# EAGLE design 16197^2 (EAGLE 7.6.0)
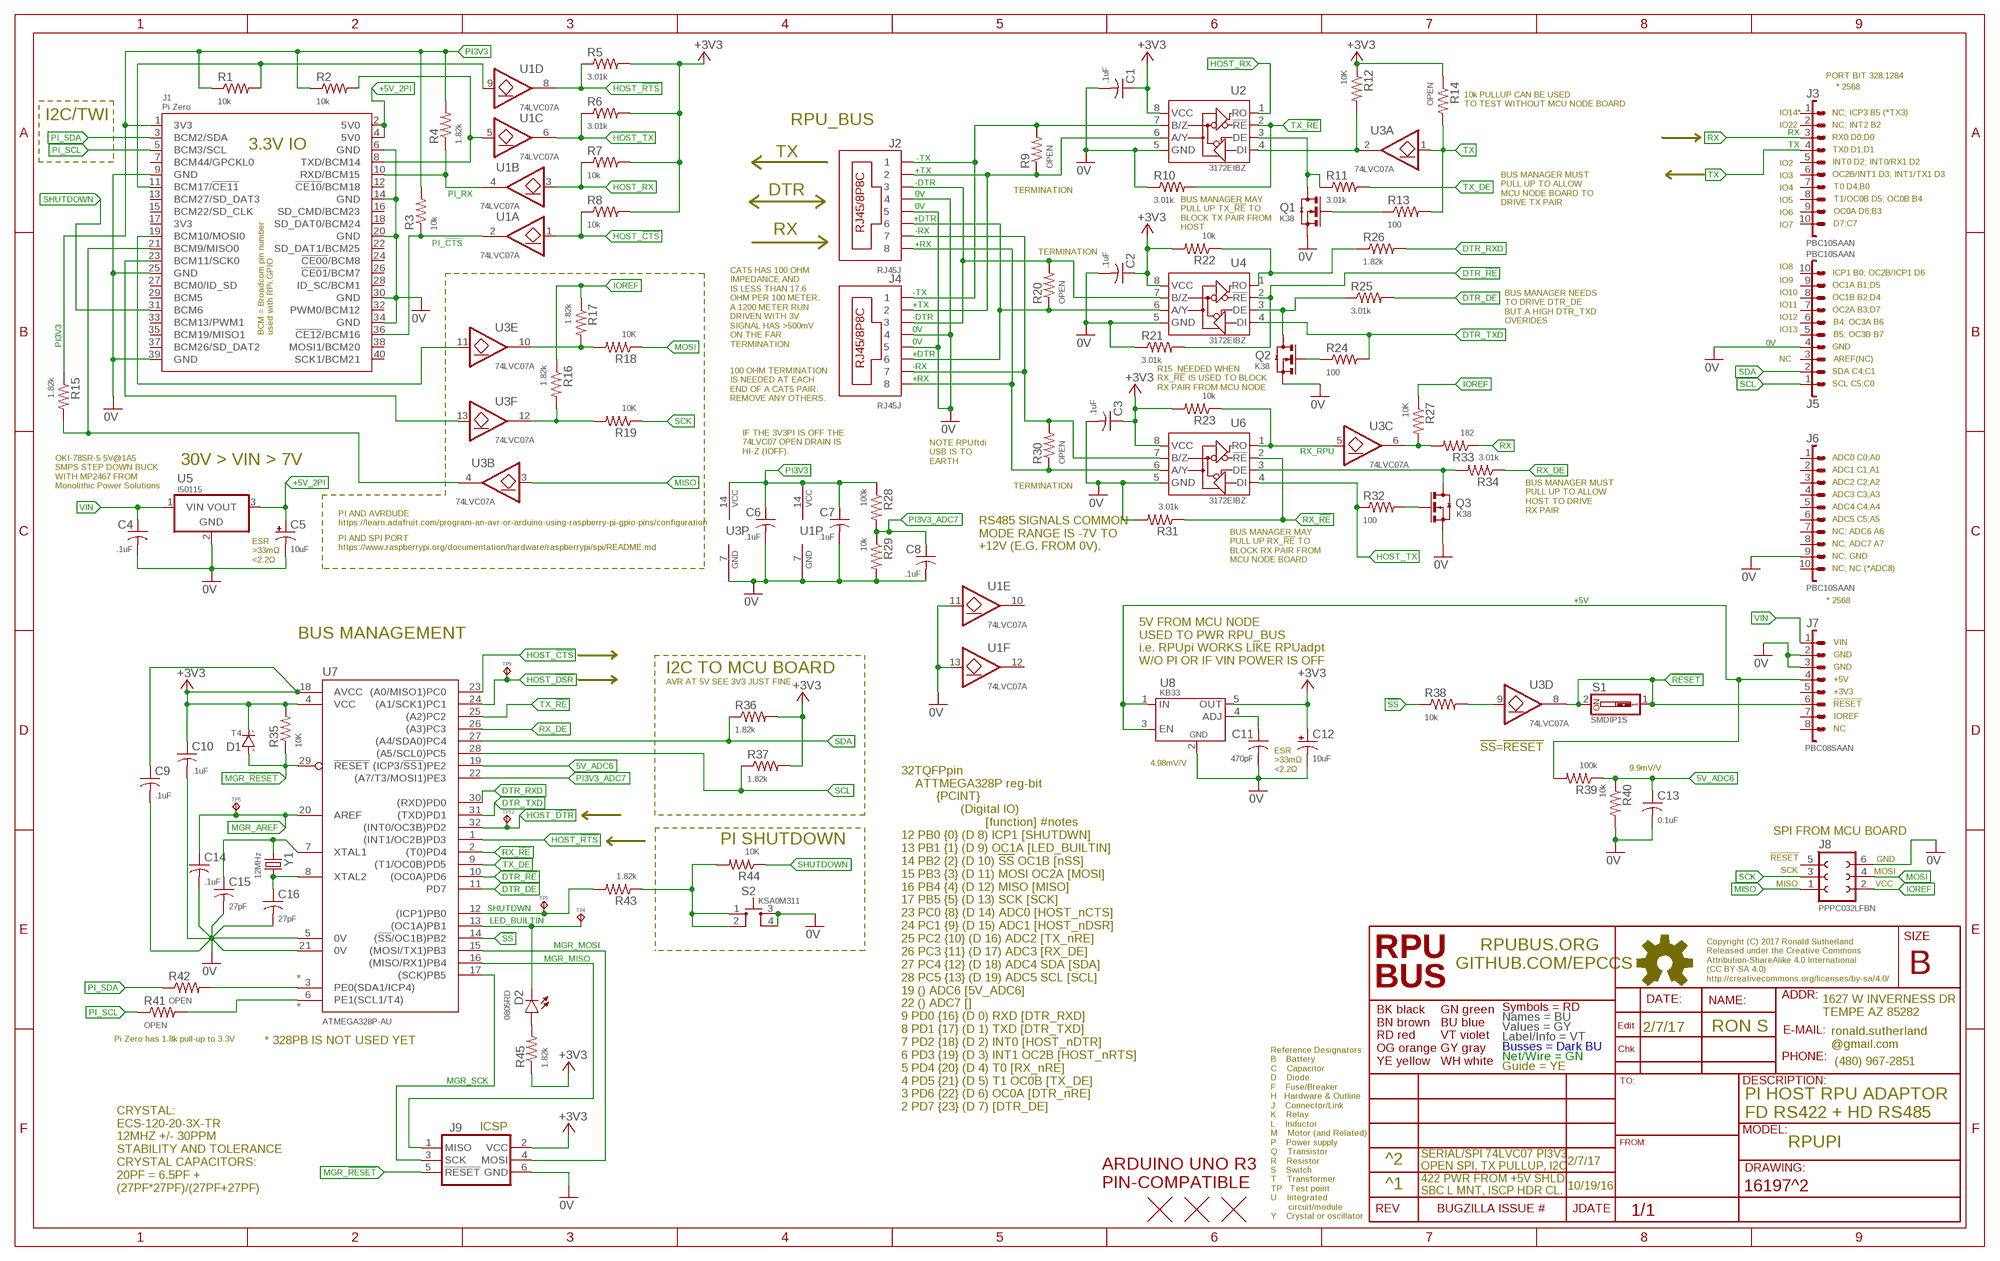
[diagram p0: schematic, sheet 1]

## Parts
C1  .1uF  CC0603A  [C0603(1608)]
C2  .1uF  CC0603A  [C0603(1608)]
C3  .1uF  CC0603A  [C0603(1608)]
C4  .1uF  CC0603A  [C0603(1608)]
C5  10uF  CT1206  [3216]
C6  .1uF  CC0603A  [C0603(1608)]
C7  .1uF  CC0603A  [C0603(1608)]
C8  .1uF  CC0603A  [C0603(1608)]
C9  .1uF  CC0603A  [C0603(1608)]
C10  .1uF  CC0603A  [C0603(1608)]
C11  470pF  CC0603A  [C0603(1608)]
C12  10uF  CT1206  [3216]
C13  0.1uF  CC0603A  [C0603(1608)]
C14  .1uF  CC0603A  [C0603(1608)]
C15  27pF  CC0603A  [C0603(1608)]
C16  27pF  CC0603A  [C0603(1608)]
D1  T4  DSOD123  [SOD123]
D2  0805RD  LEDC0805(2012)  [C0805(2012)]
J1  Pi Zero  RPI-ZERO90  [RASPI_ZERO_V40PIN]
J2  RJ45J  RJ45-8HZT  [RJ45-8HZT]
J3  PBC10SAAN  1X10"  [1X10]
J4  RJ45J  RJ45-8HZT  [RJ45-8HZT]
J5  PBC10SAAN  1X10"  [1X10]
J6  PBC10SAAN  1X10"  [1X10]
J7  PBC08SAAN  1X8"  [1X8]
J8  PPPC032LFBN  F2X3  [F2X3]
J9  ISP-SPIPTH  [ISP]
Q1  K38  N-CHSOT23  [SOT23]
Q2  K38  N-CHSOT23  [SOT23]
Q3  K38  N-CHSOT23  [SOT23]
R1  10k  R0805  [C0805(2012)]
R2  10k  R0805  [C0805(2012)]
R3  10k  R0805  [C0805(2012)]
R4  1.82k  R0805  [C0805(2012)]
R5  3.01k  R0805  [C0805(2012)]
R6  3.01k  R0805  [C0805(2012)]
R7  10k  R0805  [C0805(2012)]
R8  10k  R0805  [C0805(2012)]
R9  OPEN  R0805  [C0805(2012)]
R10  3.01k  R0805  [C0805(2012)]
R11  3.01k  R0805  [C0805(2012)]
R12  10K  R0805  [C0805(2012)]
R13  100  R0805  [C0805(2012)]
R14  OPEN  R0805  [C0805(2012)]
R15  1.82k  R0805  [C0805(2012)]
R16  1.82k  R0805  [C0805(2012)]
R17  1.82k  R0805  [C0805(2012)]
R18  10K  R0805  [C0805(2012)]
R19  10K  R0805  [C0805(2012)]
R20  OPEN  R0805  [C0805(2012)]
R21  3.01k  R0805  [C0805(2012)]
R22  10k  R0805  [C0805(2012)]
R23  10k  R0805  [C0805(2012)]
R24  100  R0805  [C0805(2012)]
R25  3.01k  R0805  [C0805(2012)]
R26  1.82k  R0805  [C0805(2012)]
R27  10K  R0805  [C0805(2012)]
R28  100k  R0805  [C0805(2012)]
R29  10k  R0805  [C0805(2012)]
R30  OPEN  R0805  [C0805(2012)]
R31  3.01k  R0805  [C0805(2012)]
R32  100  R0805  [C0805(2012)]
R33  182  R0805  [C0805(2012)]
R34  3.01k  R0805  [C0805(2012)]
R35  10K  R0805  [C0805(2012)]
R36  1.82k  R0805  [C0805(2012)]
R37  1.82k  R0805  [C0805(2012)]
R38  10k  R0805  [C0805(2012)]
R39  100k  R0805  [C0805(2012)]
R40  10k  R0805  [C0805(2012)]
R41  OPEN  R0805  [C0805(2012)]
R42  OPEN  R0805  [C0805(2012)]
R43  1.82k  R0805  [C0805(2012)]
R44  10K  R0805  [C0805(2012)]
R45  1.82k  R0805  [C0805(2012)]
S1  SMDIP1S  SW_DIP-1SMD  [SMD-DIPSWITCH-1]
S2  KSA0M311  [0M311]
TP1  TPPAD1-08  [P1-08]
TP4  TPPAD1-08  [P1-08]
TP5  TPPAD1-08  [P1-08]
TP9  TPPAD1-08  [P1-08]
TP12  TPPAD1-08  [P1-08]
U1  74LVC07A  7407D  [14SOIC]
U2  3172EIBZ  ISL3172EIBZ  [SOIC8]
U3  74LVC07A  7407D  [14SOIC]
U4  3172EIBZ  ISL3172EIBZ  [SOIC8]
U5  I50115  OKI-78SR-H  [OKI-78SR-H]
U6  3172EIBZ  ISL3172EIBZ  [SOIC8]
U7  ATMEGA328P-AU  ATMEGA328PB-AU  [TQFP32-08]
U8  KB33  MIC5205  [SOT23-5,SOT25]
U$1  ARDUINO-UNO  [ARDUINO_UNO]
U$2  FIDUCIAL1.27  [FIDUCIAL-1.27]
U$3  FIDUCIAL1.27  [FIDUCIAL-1.27]
U$4  FIDUCIAL1.27  [FIDUCIAL-1.27]
Y1  12MHz  CSM-3X  [CSM-3X]

## Nets
0V: C1.2 C2.2 C3.2 C4.2 C5.- C6.2 C7.2 C8.2 C9.2 C10.2 C11.2 C12.- C13.2 C14.2 C15.2 C16.2 J1.6(GND) J1.9(GND) J1.14(GND) J1.20(GND) J1.25(GND) J1.30(GND) J1.34(GND) J1.39(GND) J2.4 J2.5 J4.4 J4.5 J5.4 J6.9 J7.2 J7.3 J8.6 J9.6(GND) Q1.2(S)(S) Q2.2(S)(S) Q3.2(S)(S) R10.1 R21.1 R29.2 R31.2 R40.2 S2.3 S2.4 U1.7(P:GND) U1.11(E:I) U1.13(F:I) U2.5(GND) U3.7(P:GND) U4.5(GND) U5.2(GND) U6.5(GND) U7.5(0V) U7.21(0V) U8.2(GND)
5V_ADC6: C13.1 R39.1 R40.1 U7.19((ICP3/!SS1!)PE2)
!RESET: J7.6 S1.1 S1.2 U3.8(D:O)
!SS!: R38.1 U7.14((!SS!/OC1B)PB2)
+3V3: C1.1 C2.1 C3.1 C9.1 C10.1 C12.+ D1.C(K) J9.2(VCC) R5.2 R6.2 R7.2 R8.2 R12.1 R14.1 R22.2 R23.2 R35.2 R36.2 R37.2 R45.1 U2.8(VCC) U4.8(VCC) U6.8(VCC) U7.4(VCC) U7.18(AVCC) U8.5(OUT)
+5V: J7.4 R39.2 U8.1(IN) U8.3(EN)
+5V_2PI: C5.+ J1.2(5V0) J1.4(5V0) U5.3(VOUT)
+DTR: J2.6 J4.6 R20.1 U4.6(A/Y)
+RX: J2.8 J4.8 R30.1 U6.6(A/Y)
+TX: J2.2 J4.2 R9.1 U2.6(A/Y)
-DTR: J2.3 J4.3 R20.2 U4.7(B/Z)
-RX: J2.7 J4.7 R30.2 U6.7(B/Z)
-TX: J2.1 J4.1 R9.2 U2.7(B/Z)
DTR_!RE: R21.2 U4.2(!RE) U7.10((OC0A)PD6)
DTR_DE: R25.2 U7.11(PD7)
DTR_RXD: R26.2 U7.30((RXD)PD0)
DTR_TXD: R24.2 U4.4(DI) U7.31((TXD)PD1)
HOST_!CTS: R8.1 U1.1(A:I) U7.23((A0/MISO1)PC0)
HOST_!DSR: TP9.TP U7.24((A1/SCK1)PC1)
HOST_!DTR: TP12.TP U7.32((INT0/OC3B)PD2)
HOST_!RTS: R5.1 U1.8(D:O) U7.1((INT1/OC2B)PD3)
HOST_MISO: J1.21(BCM9/MISO0) R15.2 U3.4(B:O)
HOST_MOSI: J1.19(BCM10/MOSI0) U3.11(E:I)
HOST_RX: R7.1 U1.3(B:I) U2.1(RO)
HOST_SCK: J1.23(BCM11/SCK0) U3.13(F:I)
HOST_TX: R6.1 R32.1 U1.6(C:O) U6.4(DI)
IOREF: J8.2 R16.1 R17.1 R27.1
LED_BUILTIN: D2.K TP4.TP U7.13((OC1A)PB1)
MGR_!RESET: D1.A J9.5(!RESET) R35.1 U7.29(!RESET)
MGR_AREF: C14.1 TP5.TP U7.20(AREF)
MGR_MISO: J9.1(MISO) U7.16((MISO/RX1)PB4)
MGR_MOSI: J9.4(MOSI) U7.15((MOSI/TX1)PB3)
MGR_SCK: J9.3(SCK) U7.17((SCK)PB5)
MISO: J8.1 U3.3(B:I)
MOSI: J8.4 R18.1
N$1: J1.8(TXD/BCM14) R2.2 U1.5(C:I)
N$2: R38.2 U3.9(D:I)
N$4: J1.11(BCM17/!CE11!) R1.2 U1.9(D:I)
N$5: R16.2 R19.2 U3.12(F:O)
N$6: R17.2 R18.2 U3.10(E:O)
N$7: R43.1 R44.2 S2.1 S2.2
N$10: R27.2 R33.2 U3.6(C:O)
N$11: Q3.3(D)(D) R34.2 U6.3(DE)
N$15: Q1.1(G)(G) R13.1
N$18: Q1.3(D)(D) R11.1 U2.3(DE)
N$19: R22.1 R26.1 U4.1(RO)
N$20: Q2.3(D)(D) R25.1 U4.3(DE)
N$22: Q2.1(G)(G) R24.1
N$24: C11.1 U8.4(ADJ)
N$25: Q3.1(G)(G) R32.2
N$29: D2.A R45.2
PI3V3: C6.1 C7.1 J1.1(3V3) R1.1 R2.1 R3.2 R4.2 R15.1 R28.1 U1.14(P:VCC) U3.14(P:VCC)
PI3V3_ADC7: C8.1 R28.2 R29.1 U7.22((A7/T3/MOSI1)PE3)
PI_!CTS: J1.36(!CE12!/BCM16) R3.1 U1.2(A:O)
PI_RX: J1.10(RXD/BCM15) R4.1 U1.4(B:O)
PI_SCL: J1.5(BCM3/SCL) R41.1
PI_SDA: J1.3(BCM2/SDA) R42.1
RX: J3.3 R33.1
RX_!RE: R31.1 U6.2(!RE) U7.2((T0)PD4)
RX_DE: R34.1 U7.26((A3)PC3)
RX_RPU: R23.1 U3.5(C:I) U6.1(RO)
SCK: J8.3 R19.1
SCL: J5.1 R37.1 U7.28((A5/SCL0)PC5)
SCL1: R41.2 U7.6(PE1(SCL1/T4))
SDA: J5.2 R36.1 U7.27((A4/SDA0)PC4)
SDA1: R42.2 U7.3(PE0(SDA1/ICP4))
SHUTDOWN: J1.31(BCM6) R44.1
SHUTDWN: R43.2 TP1.TP U7.12((ICP1)PB0)
TX: J3.4 R13.2 R14.2 U3.1(A:I)
TX_!RE: R10.2 U2.2(!RE) U7.25((A2)PC2)
TX_DE: R11.2 U7.9((T1/OC0B)PD5)
TX_RPU: R12.2 U2.4(DI) U3.2(A:O)
VIN: C4.1 J7.1 U5.1(VIN)
XTAL1: C15.1 U7.7(XTAL1) Y1.1
XTAL2: C16.1 U7.8(XTAL2) Y1.2
Unconnected: J1.7(BCM44/GPCKL0) J1.12(!CE10!/BCM18) J1.13(BCM27/SD_DAT3) J1.15(BCM22/SD_CLK) J1.16(SD_CMD/BCM23) J1.17(3V3) J1.18(SD_DAT0/BCM24) J1.22(SD_DAT1/BCM25) J1.24(!CE00!/BCM8) J1.26(!CE01!/BCM7) J1.27(BCM0/ID_SD) J1.28(ID_SC/BCM1) J1.29(BCM5) J1.32(PWM0/BCM12) J1.33(BCM13/PWM1) J1.35(BCM19/MISO1) J1.37(BCM26/SD_DAT2) J1.38(MOSI1/BCM20) J1.40(SCK1/BCM21) J3.1 J3.2 J3.5 J3.6 J3.7 J3.8 J3.9 J3.10 J5.3 J5.5 J5.6 J5.7 J5.8 J5.9 J5.10 J6.1 J6.2 J6.3 J6.4 J6.5 J6.6 J6.7 J6.8 J6.10 J7.5 J7.7 J7.8 J8.5 U1.10(E:O) U1.12(F:O)

## Notes on the sheet
- PORT BIT 328;1284
- * 2568
- 10k PULLUP CAN BE USED 
  TO TEST WITHOUT MCU NODE BOARD
- IO14* | NC; ICP3 B5 (*TX3)
- I2C/TWI
- RPU_BUS | IO22 | NC; INT2 B2
- RX0 D0;D0
- TX0 D1;D1
- TX
- IO2 | INT0 D2; INT0/RX1 D2
- IO3 | OC2B/INT1 D3; INT1/TX1 D3
- IO4 | T0 D4;B0
- DTR | TERMINATION
- IO5 | T1/OC0B D5; OC0B B4
- BUS MANAGER MUST
  PULL UP TO ALLOW 
  MCU NODE BOARD TO 
  DRIVE TX PAIR
- IO6 | OC0A D6;B3
- IO7 | D7;C7
- BUS MANAGER MAY
  PULL UP TX_!RE! TO 
  BLOCK TX PAIR FROM 
  HOST
- RX
- TERMINATION
- IO8
- ICP1 B0; OC2B/ICP1 D6
- IO9
- OC1A B1;D5
- IO10
- OC1B B2;D4
- IO11
- OC2A B3;D7
- IO12
- BUS MANAGER NEEDS
  TO DRIVE DTR_DE
  BUT A HIGH DTR_TXD
  OVERIDES
- B4; OC3A B6
- IO13
- B5; OC3B B7
- CAT5 HAS 100 OHM 
  IMPEDANCE AND 
  IS LESS THAN 17.6 
  OHM PER 100 METER. 
  A 1200 METER RUN
  DRIVEN WITH 3V 
  SIGNAL HAS >500mV
  ON THE FAR
  TERMINATION
- GND
- NC | AREF(NC)
- SDA C4;C1
- SCL C5;C0
- R15  NEEDED WHEN 
  RX_!RE! IS USED TO BLOCK 
  RX PAIR FROM MCU NODE
- 100 OHM TERMINATION
  IS NEEDED AT EACH
  END OF A CAT5 PAIR.
  REMOVE ANY OTHERS.
- IF THE 3V3PI IS OFF THE
  74LVC07 OPEN DRAIN IS
  HI-Z (IOFF).
- ADC0 C0;A0
- NOTE RPUftdi 
  USB IS TO 
  EARTH
- 30V > VIN > 7V
- ADC1 C1;A1
- ADC2 C2;A2
- OKI-78SR-5 5V@1A5
  SMPS STEP DOWN BUCK
  WITH MP2467 FROM 
  Monolithic Power Solutions
- TERMINATION
- ADC3 C3;A3
- ADC4 C4;A4
- BUS MANAGER MUST
  PULL UP TO ALLOW 
  HOST TO DRIVE
  RX PAIR
- ADC5 C5;A5
- PI AND AVRDUDE
  https://learn.adafruit.com/program-an-avr-or-arduino-using-raspberry-pi-gpio-pins/configuration
- NC; ADC6 A6
- NC; ADC7 A7
- PI AND SPI PORT
  https://www.raspberrypi.org/documentation/hardware/raspberrypi/spi/README.md
- RS485 SIGNALS COMMON 
  MODE RANGE IS -7V TO 
  +12V (E.G. FROM 0V).
- NC; GND
- ESR
  >33mΩ
  <2.2Ω
- BUS MANAGER MAY
  PULL UP RX_!RE! TO 
  BLOCK RX PAIR FROM
  MCU NODE BOARD
- NC; NC (*ADC8)
- * 2568
- BUS MANAGEMENT
- VIN
- GND
- 5V FROM MCU NODE
  USED TO PWR RPU_BUS
  i.e. RPUpi WORKS LIKE RPUadpt
  W/O PI OR IF VIN POWER IS OFF
- GND
- I2C TO MCU BOARD
- AVR AT 5V SEE 3V3 JUST FINE. | +5V
- +3V3
- !RESET
- IOREF
- NC
- !SS!=!RESET!
- 4.98mV/V
- 9.9mV/V
- ESR
  >33mΩ
  <2.2Ω
- SPI FROM MCU BOARD
- PI SHUTDOWN
- !RESET
- GND
- SCK
- MOSI
- MISO
- VCC
- *
- *
- 2/7/17 | RON S
- Pi Zero has 1.8k pull-up to 3.3V
- * 328PB IS NOT USED YET
- 32TQFPpin
      ATTMEGA328P reg-bit
            {PCINT}
                   (Digital IO)
                          [function] #notes
  12 PB0 {0} (D 8) ICP1 [SHUTDWN]
  13 PB1 {1} (D 9) OC1A [LED_BUILTIN]
  14 PB2 {2} (D 10) !SS! OC1B [nSS]
  15 PB3 {3} (D 11) MOSI OC2A [MOSI]
  16 PB4 {4} (D 12) MISO [MISO]
  17 PB5 {5} (D 13) SCK [SCK]
  23 PC0 {8} (D 14) ADC0 [HOST_nCTS]
  24 PC1 {9} (D 15) ADC1 [HOST_nDSR]
  25 PC2 {10} (D 16) ADC2 [TX_nRE]
  26 PC3 {11} (D 17) ADC3 [RX_DE]
  27 PC4 {12} (D 18) ADC4 SDA [SDA]
  28 PC5 {13} (D 19) ADC5 SCL [SCL]
  19 () ADC6 [5V_ADC6]
  22 () ADC7 []
  9 PD0 {16} (D 0) RXD [DTR_RXD]
  8 PD1 {17} (D 1) TXD [DTR_TXD]
  7 PD2 {18} (D 2) INT0 [HOST_nDTR]
  6 PD3 {19} (D 3) INT1 OC2B [HOST_nRTS]
  5 PD4 {20} (D 4) T0 [RX_nRE]
  4 PD5 {21} (D 5) T1 OC0B [TX_DE]
  3 PD6 {22} (D 6) OC0A [DTR_nRE]
  2 PD7 {23} (D 7) [DTR_DE]
- PI HOST RPU ADAPTOR 
  FD RS422 + HD RS485
- ICSP
- RPUPI
- ^2 | 2/7/17
- SERIAL/SPI 74LVC07 PI3V3
  OPEN SPI, TX PULLUP, I2C
- ^1 | 10/19/16
- CRYSTAL:
  ECS-120-20-3X-TR
  12MHZ +/- 30PPM
  STABILITY AND TOLERANCE
  CRYSTAL CAPACITORS:
  20PF = 6.5PF +
  (27PF*27PF)/(27PF+27PF)
- 422 PWR FROM +5V SHLD,
  SBC L MNT, ISCP HDR CL.

## Library data of the parts
C1-C4 C6-C11 C13-C16 = C-C:C: CAPACITOR Symbol
C5 C12 = C-T:CT: Tantalum Electrolytic Capacitor
D1 = D-GP:D: DIODE
D2 = D-LED:LED: LED 120120WH [CREE,XHGAWT-00-0000-00000HXE1] LED WHITE 6500K 150LUM-W120120
J1 = U-Pi:RPI-ZERO: Raspberry Pi Zero https://pinout.xyz/ NOTE: WiFi is needed see https://www.kickstarter.com/projects/1991736672/iot-hat-for-raspberry-pi-a-must-have-for-pi-zero
J2 J4 = J-RJ45:RJ45-8: RJ45 Jack RJ45J [ASSMANN,A-2014-2-4-R] JACK MODULAR VERT PCB 8P8C UNSHIELD Horz version form sparkfun sku PRT-00643, and breakout board sku is BOB-00716.
J3 J5 J6 = J-HDR2.54mm:1X10: 10 POS HEADER PBC10S [SULLINS,PBC10SAAN]HEADER MALE BRKWAY 10POS .1IN AA
J7 = J-HDR2.54mm:1X8: 8 POS HEADER PBC08SAAN [SULLINS,PBC08SAAN]HEADER MALE BRKWAY 8POS .1IN AA
J8 = J-HDR2.54mm:F2X3: FEMALE HEADER 2X3POS
J9 = U-AVR:ISP-SPI: AVR ISP thru SPI In-System Programming uses the target Atmel AVR’s internal SPI (Serial Peripheral Interface) to download code into the flash and EEPROM memories. It is not a debugging interface. When designing an application PCB which includes an AVR with the SPI interface, this pinout should be used. Sparkfun SKU: BOB-08508
Q1-Q3 = Q-NCH:N-CH?*: ENHANCEMENT MODE MOSFET SOT23 is BSS138 pinout
R1-R45 = R-C:R: Resiistor American-style symbol
S1 = S-Toggle:SW_DIP-1
S2 = S-Tactile:KSA: KSA0M311 [C&K,KSA0M311LFT] SWITCH TACTILE SEALED SPST-NO 50MA 32V
TP1 TP4 TP5 TP9 TP12 = J-TP:TP: Test pad
U1 U3 = U-7400:74*07: HEX BUFFER, OPEN DRAIN/COLLECTOR 74LVC07A [DIODES,74LVC07AS14-13] LOGIC BUFFER OPEN DRAIN 14SOIC
U2 U4 U6 = U-Transceiver:ISL3172E: TRANSCEIVER RS485 3.3V HALFDPLX
U5 = P-DCDC:OKI-78SR: OKI-78SR OKI-78SR-5/1.5-W36H-C 5V@1.5A Horizontal Mount OKI-78SR-5/1.5-W36-C 5V@1.5A Vert Mount OKI-78SR-3.3/1.5-W36H-C 3.3V@1.5A Horizontal Mount OKI-78SR-3.3/1.5-W36-C 3.3V@1.5A Vert Mount Murata Power Solutions 7 to 36 VDC input range need to verify pinout
U7 = U-AVR:ATMEGA328PB-AU: ATmega328PB 4 Kbytes FLASH 128 bytes SRAM 256 bytes EEPROM 2 UART, 2 I2C, 2 SPI 8-channel 10 bit ADC
U8 = P-DCDC:MIC5205: KB33 [MICREL,MIC5205-3.3YM5] REG ULDO 3V3 150MA SOT23-5
U$1 = J-BoardHDR:ARDUINO-UNO: Board Outline with holes and silk note the board dim layer is not defined
U$2-U$4 = H-Fiducial:FIDUCIAL: Fiducial Alignment Points Various fiducial points for machine vision alignment.
Y1 = Y-XTL:CSM: 16MHZ20 [ECS,ECS-160-20-3X-TR] CRYSTAL 16MHZ 20PF 30PPM CSM-3X

## Net classes
0 default: width 0.254 mm, drill 0.33 mm

## Board
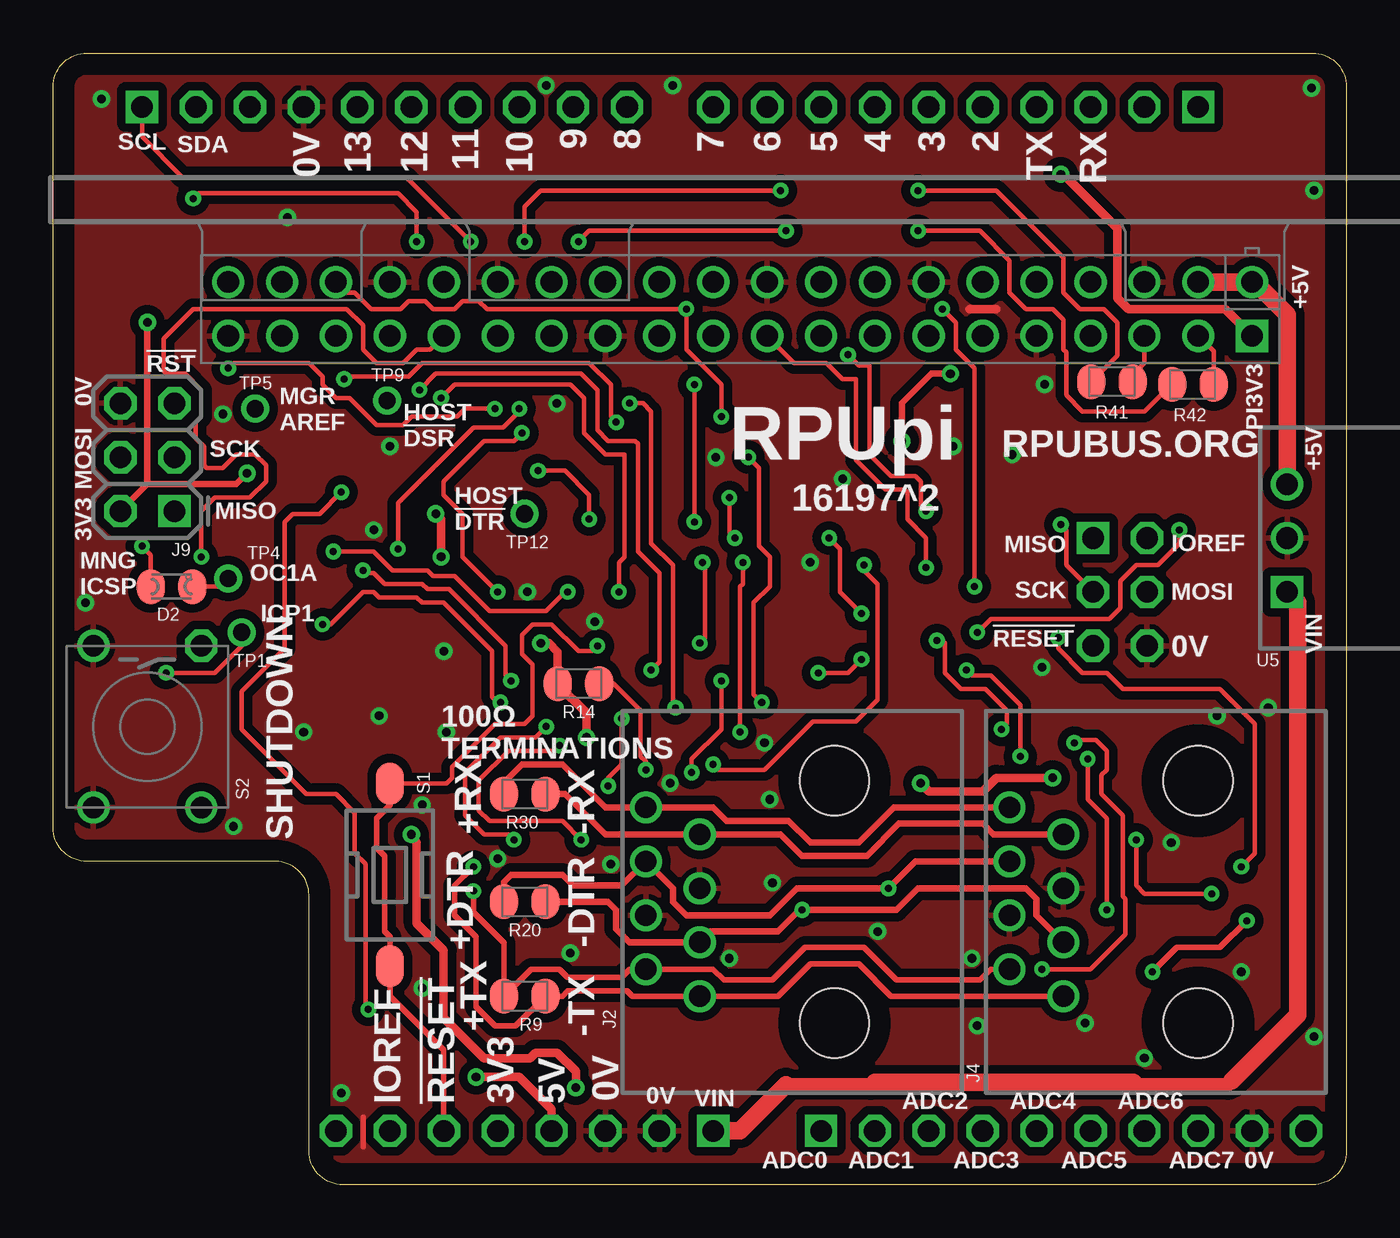
[diagram p1: board, top side]
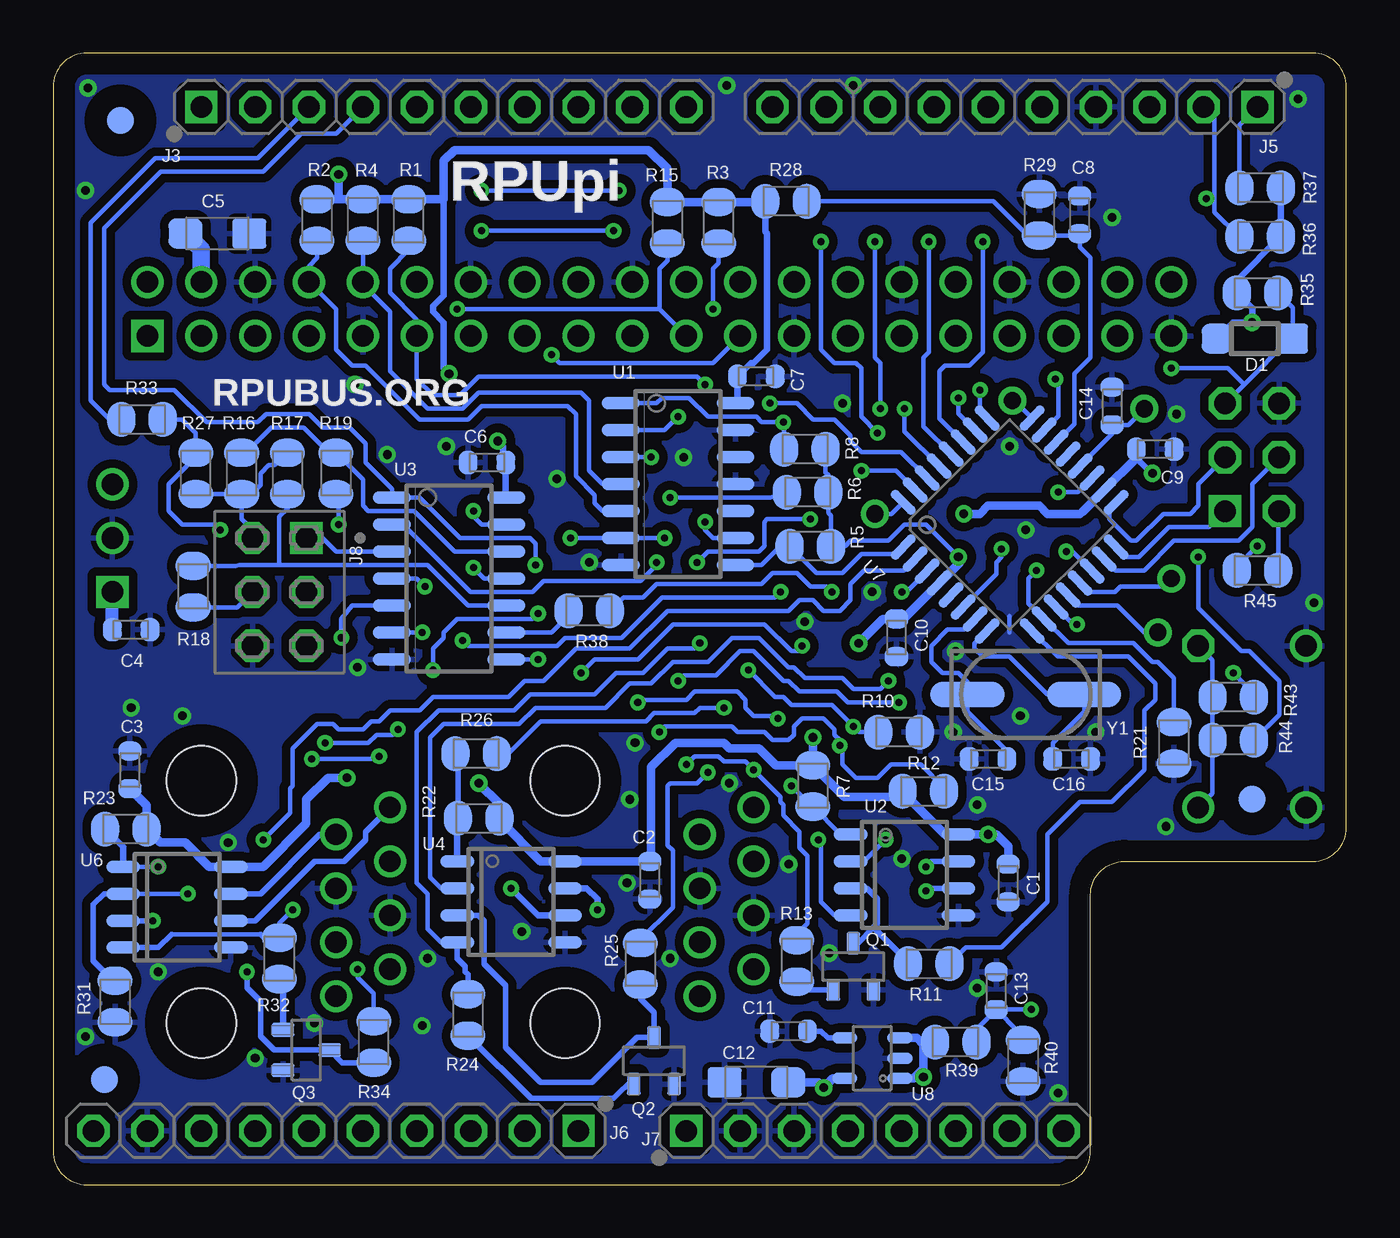
[diagram p2: board, bottom side, seen from below]

Size 60.96 x 53.34 mm. Coordinates in mm from the lower left corner, seen from the top.
Outline: 60.96,51.75 60.96,1.59 arc-90 59.37,0 13.65,0 arc-90 12.06,1.59 12.06,13.65 arc90 10.48,15.24 1.59,15.24 arc-90 0,16.83 0,51.75 arc-90 1.59,53.34 59.37,53.34 arc-90 60.96,51.75
Copper layers (1*16): Top 0.034290625mm / dielectric 60mil / Bottom 0.034290625mm
Design rules "default *": minimum track width 10mil, minimum drill 13mil, track to track 8mil, track to pad 8mil, pad to pad 8mil, via to via 8mil, smd to smd 8mil, copper to edge 40mil, drill to drill 12mil, minimum pad ring 10mil, minimum via ring 8mil, stop-mask expansion 4mil, vias tented up to drill 17mil, thermal gap 10mil

### Footprints (pad centres in the part's own frame; a part is rotated, then mirrored left to right if it is on the bottom)
C0603(1608) = smd 0.898 x 1.1: 1 -0.889,0; 2 0.889,0
3216 = smd 1.6 x 1.4: + -1.5,0; - 1.5,0
SOD123 = smd 1.4 x 1.4: A 1.8,0; C -1.8,0
C0805(2012) = smd 1.321 x 1.651: A 0.977,0; K -0.977,0
RASPI_ZERO_V40PIN = drill 1.016 square: 1 0,2.54 | drill 1.016: 2 0,0; 3 2.54,2.54; 4 2.54,0; 5 5.08,2.54; 6 5.08,0; 7 7.62,2.54; 8 7.62,0; 9 10.16,2.54; 10 10.16,0; 11 12.7,2.54; 12 12.7,0; 13 15.24,2.54; 14 15.24,0; 15 17.78,2.54; 16 17.78,0; 17 20.32,2.54; 18 20.32,0; 19 22.86,2.54; 20 22.86,0; 21 25.4,2.54; 22 25.4,0; 23 27.94,2.54; 24 27.94,0; 25 30.48,2.54; 26 30.48,0; 27 33.02,2.54; 28 33.02,0; 29 35.56,2.54; 30 35.56,0; 31 38.1,2.54; 32 38.1,0; 33 40.64,2.54; 34 40.64,0; 35 43.18,2.54; 36 43.18,0; 37 45.72,2.54; 38 45.72,0; 39 48.26,2.54; 40 48.26,0
RJ45-8HZT = drill 1: 1 -4.445,6.35; 2 -3.175,8.89; 3 -1.905,6.35; 4 -0.635,8.89; 5 0.635,6.35; 6 1.905,8.89; 7 3.175,6.35; 8 4.445,8.89 | hole 3.264: -5.715,0; 5.715,0
1X10 = drill 1.016 square: 1 0,0 | drill 1.016 octagon: 2 2.54,0; 3 5.08,0; 4 7.62,0; 5 10.16,0; 6 12.7,0; 7 15.24,0; 8 17.78,0; 9 20.32,0; 10 22.86,0
1X8 = drill 1.016 square: 1 0,0 | drill 1.016 octagon: 2 2.54,0; 3 5.08,0; 4 7.62,0; 5 10.16,0; 6 12.7,0; 7 15.24,0; 8 17.78,0
F2X3 = drill 1.016 square: 1 0,0 | drill 1.016 octagon: 2 0,-2.54; 3 2.54,0; 4 2.54,-2.54; 5 5.08,0; 6 5.08,-2.54
ISP = drill 1.016 square: 1 0,0 | drill 1.016 octagon: 2 0,2.54; 3 2.54,0; 4 2.54,2.54; 5 5.08,0; 6 5.08,2.54
SOT23 = smd 0.65 x 1.06: 1(G) -0.95,-1.1; 2(S) 0.95,-1.1; 3(D) 0,1.1
C0805(2012)' = smd 1.321 x 1.651: 1 -0.977,0; 2 0.977,0
SMD-DIPSWITCH-1 = smd 1.3 x 2: 1 0,-4.3; 2 0,4.3
0M311 = drill 1.016 octagon: 1 -3.81,2.54 | drill 1.016: 2 3.81,2.54; 3 -3.81,-2.54; 4 3.81,-2.54
P1-08 = drill 0.813: TP 0,0
14SOIC = smd 0.6 x 1.8: 1 -3.81,-2.7; 2 -2.54,-2.7; 3 -1.27,-2.7; 4 0,-2.7; 5 1.27,-2.7; 6 2.54,-2.7; 7 3.81,-2.7; 8 3.81,2.7; 9 2.54,2.7; 10 1.27,2.7; 11 0,2.7; 12 -1.27,2.7; 13 -2.54,2.7; 14 -3.81,2.7
SOIC8 = smd 0.6 x 1.6: 1 -1.905,-2.54; 2 -0.635,-2.54; 3 0.635,-2.54; 4 1.905,-2.54; 5 1.905,2.54; 6 0.635,2.54; 7 -0.635,2.54; 8 -1.905,2.54
OKI-78SR-H = drill 1.016 square: 1 0,0 | drill 1.016: 2 -2.54,0; 3 -5.08,0
TQFP32-08 = smd 1.5 x 0.45: 1 -4.293,2.8; 2 -4.293,2; 3 -4.293,1.2; 4 -4.293,0.4; 5 -4.293,-0.4; 6 -4.293,-1.2; 7 -4.293,-2; 8 -4.293,-2.8; 17 4.293,-2.8; 18 4.293,-2; 19 4.293,-1.2; 20 4.293,-0.4; 21 4.293,0.4; 22 4.293,1.2; 23 4.293,2; 24 4.293,2.8 | smd 0.45 x 1.5: 9 -2.8,-4.293; 10 -2,-4.293; 11 -1.2,-4.293; 12 -0.4,-4.293; 13 0.4,-4.293; 14 1.2,-4.293; 15 2,-4.293; 16 2.8,-4.293; 25 2.8,4.293; 26 2,4.293; 27 1.2,4.293; 28 0.4,4.293; 29 -0.4,4.293; 30 -1.2,4.293; 31 -2,4.293; 32 -2.8,4.293
SOT23-5,SOT25 = smd 0.55 x 1.2: 1 -0.95,-1.3; 2 0,-1.3; 3 0.95,-1.3; 4 0.95,1.3; 5 -0.95,1.3
FIDUCIAL-1.27 = smd 1.27 x 1.27: 1 0,0
CSM-3X = smd 3.5 x 1.2: 1 -2.75,0; 2 2.75,0

### Placement (x,y rotation side)
C1  15.94,14.22 270 bottom
C2  32.83,14.35 270 bottom
C3  57.34,19.56 90 bottom
C4  57.28,26.16 0 bottom
C5  53.21,44.83 0 bottom
C6  40.51,34.04 180 bottom
C7  27.81,38.1 0 bottom
C8  12.57,45.72 90 bottom
C9  9.02,34.67 0 bottom
C10  21.21,25.78 270 bottom
C11  26.29,7.24 180 bottom
C12  27.81,4.83 180 bottom
C13  16.51,9.14 90 bottom
C14  11.05,36.7 90 bottom
C15  16.89,20.07 180 bottom
C16  12.95,20.07 0 bottom
D1  4.32,39.88 0 bottom
D2  5.59,28.19 180 top
J1  56.52,42.55 180 top
J2  36.83,13.34 90 top
J3  53.98,50.8 0 bottom
J4  53.98,13.34 90 top
J5  4.19,50.8 180 bottom
J6  36.2,2.54 180 bottom
J7  31.12,2.54 0 bottom
J8  49.02,30.48 270 bottom
J9  5.71,31.75 90 top
Q1  23.24,10.29 0 bottom
Q2  32.64,5.84 0 bottom
Q3  49.02,6.35 270 bottom
R1  10k  [C0805(2012)']  44.2,45.47 270 bottom
R2  10k  [C0805(2012)']  48.51,45.47 270 bottom
R3  10k  [C0805(2012)']  29.59,45.34 90 bottom
R4  1.82k  [C0805(2012)']  46.35,45.47 90 bottom
R5  3.01k  [C0805(2012)']  25.27,30.1 0 bottom
R6  3.01k  [C0805(2012)']  25.4,32.64 0 bottom
R7  10k  [C0805(2012)']  25.15,18.8 90 bottom
R8  10k  [C0805(2012)']  25.53,34.67 0 bottom
R9  OPEN  [C0805(2012)']  22.23,8.89 0 top
R10  3.01k  [C0805(2012)']  21.08,21.34 180 bottom
R11  3.01k  [C0805(2012)']  19.69,10.41 0 bottom
R12  10K  [C0805(2012)']  19.94,18.54 0 bottom
R13  100  [C0805(2012)']  25.91,10.54 90 bottom
R14  OPEN  [C0805(2012)']  24.77,23.62 0 top
R15  1.82k  [C0805(2012)']  32,45.34 270 bottom
R16  1.82k  [C0805(2012)']  52.07,33.53 90 bottom
R17  1.82k  [C0805(2012)']  49.91,33.53 270 bottom
R18  10K  [C0805(2012)']  54.36,28.19 90 bottom
R19  10K  [C0805(2012)']  47.62,33.53 90 bottom
R20  OPEN  [C0805(2012)']  22.23,13.34 0 top
R21  3.01k  [C0805(2012)']  8.13,20.83 90 bottom
R22  10k  [C0805(2012)']  40.89,17.27 0 bottom
R23  10k  [C0805(2012)']  57.53,16.76 0 bottom
R24  100  [C0805(2012)']  41.4,8 90 bottom
R25  3.01k  [C0805(2012)']  33.27,10.41 90 bottom
R26  1.82k  [C0805(2012)']  41.02,20.32 0 bottom
R27  10K  [C0805(2012)']  54.23,33.53 90 bottom
R28  100k  [C0805(2012)']  26.42,46.35 0 bottom
R29  10k  [C0805(2012)']  14.48,45.72 90 bottom
R30  OPEN  [C0805(2012)']  22.23,18.41 0 top
R31  3.01k  [C0805(2012)']  58.04,8.64 270 bottom
R32  100  [C0805(2012)']  50.29,10.67 270 bottom
R33  182  [C0805(2012)']  56.77,36.07 0 bottom
R34  3.01k  [C0805(2012)']  45.85,6.73 270 bottom
R35  10K  [C0805(2012)']  4.19,42.04 180 bottom
R36  1.82k  [C0805(2012)']  4.06,44.7 0 bottom
R37  1.82k  [C0805(2012)']  4.06,46.99 0 bottom
R38  10k  [C0805(2012)']  35.69,27.05 180 bottom
R39  100k  [C0805(2012)']  18.42,6.73 180 bottom
R40  10k  [C0805(2012)']  15.24,5.84 270 bottom
R41  OPEN  [C0805(2012)']  49.91,37.85 180 top
R42  OPEN  [C0805(2012)']  53.72,37.72 180 top
R43  1.82k  [C0805(2012)']  5.33,22.99 0 bottom
R44  10K  [C0805(2012)']  5.33,20.95 180 bottom
R45  1.82k  [C0805(2012)']  4.19,28.96 180 bottom
S1  15.88,14.61 0 top
S2  4.45,21.59 270 top
TP1  8.89,26.04 0 top
TP4  8.26,28.57 0 top
TP5  9.53,36.58 0 top
TP9  15.75,36.96 0 top
TP12  22.23,31.62 0 top
U1  31.5,33.02 270 bottom
U2  20.83,14.61 270 bottom
U3  42.29,28.57 270 bottom
U4  39.37,13.34 270 bottom
U5  58.17,27.94 270 top
U6  55.12,13.08 270 bottom
U7  15.88,31.11 45 bottom
U8  22.35,5.97 90 bottom
U$1  -14.61,0 0 top  (outside the outline)
U$2  57.78,50.16 0 bottom
U$3  4.45,18.16 0 bottom
U$4  58.55,4.95 0 bottom
Y1  15.11,23.11 0 bottom

### Tracks (layer width: path | path; a pad name or v marks a point on that pad's centre or on a via)
0V  (via drill 0.41)
  Top 0.254: 14.61,1.78 14.61,3.17
  Top 0.406: 43.18,41.27 44.45,41.27
  Bottom 0.203: 15.88,26.04 15.88,26.8
  other vias: 2.29,51.18 23.24,51.82 29.21,51.82 59.31,51.69 56.01,10.03 54.86,22.1 42.42,34.8 48.64,7.62 38.86,11.94 1.52,27.43 8.51,16.89 52.7,16.13 59.44,46.86 13.59,4.32 33.91,14.22 24.38,10.92 43.31,10.67 35.69,29.34 33.53,20.83 45.21,34.42 31.24,34.29 33.78,18.16 29.08,18.92 26.29,15.11 43.56,7.49 57.28,22.48 59.44,6.99 51.43,5.97 15.37,22.1 18.42,25.15 20.96,15.37 17.4,9.27 17.4,17.91 15.11,30.86 15.88,34.8 8,36.32 11.05,45.59 46.74,37.72 37.21,33.27 46.61,24.38 31.88,10.67 18.54,21.34 11.81,21.34 25.53,26.54 22.35,27.94 23.75,36.83
  pour Top (isolate 0.406): 11.43,0 11.43,14.61 0,14.61 0,53.34 60.96,53.34 60.96,0
  pour Bottom (isolate 0.406): 0,53.34 60.96,53.34 60.96,0 11.43,0 11.43,14.61 0,14.61
5V_ADC6  (via drill 0.33)
  Top 0.203: v14.86,8.26 14.73,8.38 14.73,15.11 14.22,15.62 14.22,17.53 13.33,18.41 11.94,18.41 8.89,21.46 8.89,23.24 10.92,25.27 10.92,31.24 11.3,31.62 12.57,31.62 v13.59,32.64
  Bottom 0.203: R39.1 17.44,7.33 C13.1 | R40.1 15.49,7.24 C13.1 | C13.1 v14.86,8.26 | v13.59,32.64 12.65,32.64 U7.19
!RESET  (via drill 0.33)
  Top 0.203: v38.1,24.77 37.46,24.13 v36.07,24.13 | S1.2 15.89,18.92 18.54,18.92 18.8,19.18 18.8,19.68 20.83,21.72 22.23,21.72 22.61,22.1 22.61,24.51 22.1,25.02 22.1,25.91 22.61,26.42 23.5,26.42 24.77,25.15 25.4,25.15 v25.65,25.4
  Top 0.254: J7.6 18.42,6.35 15.88,8.89 S1.1 15.88,11.68 15.62,11.94 15.62,15.49 15.24,15.88 15.24,17.27 15.88,17.91 S1.2
  Bottom 0.203: U3.8 v38.1,24.77 | v36.07,24.13 35.43,24.77 33.4,24.77 31.75,26.42 27.43,26.42 26.16,25.15 25.78,25.15 v25.65,25.4
!SS!  (via drill 0.33)
  Top 0.203: v24.26,27.94 24.13,27.94 23.24,27.05 20.57,27.05 18.92,28.7 17.91,28.7 17.65,28.96 16,28.96 15.11,29.84 v13.21,29.84
  Bottom 0.203: R38.1 34.07,27.69 33.15,27.69 32.51,28.32 27.56,28.32 27.05,28.83 25.91,28.83 25.27,28.19 24.51,28.19 v24.26,27.94 | v13.21,29.84 12.91,29.84 U7.14
+3V3  (via drill 0.41)
  Top 0.305: v9.14,33.53 8.64,33.02 4.45,33.02 | 4.45,33.02 J9.2 | v4.45,40.64 4.45,33.02
  Top 0.406: v25.15,21.08 25.15,22.23 23.79,23.58 R14.1 23.79,25.11 23.37,25.53 v22.99,25.53 | v24.64,4.57 24.64,5.33 23.75,6.22 22.73,6.22 22.48,5.97 20.32,5.97 18.42,7.87 18.42,11.05 17.15,12.32 17.15,16.13 v16.89,16.51 | v40.89,18.92 41.27,18.54 43.81,18.54 44.45,19.18 v47.12,19.18 | v18.29,29.59 18.29,31.37 v18.03,31.62
  Bottom 0.203: R45.1 3.21,31.71 J9.2 | v18.29,29.59 19.81,31.11 20.83,31.11 21.59,30.35 23.37,30.35 23.62,30.1 R5.2 24.3,31.54 24.42,31.66 R6.2 24.42,33.44 24.55,33.57 R8.2 | R12.1 20.92,18.33 20.96,18.29
  Bottom 0.305: R22.2 39.92,17.18 | 9.91,34.26 9.18,33.53 v9.14,33.53 | R37.2 R36.2 5.17,42.62 R35.2 4.45,41.31 v4.45,40.64 5.36,40.64 D1.C
  Bottom 0.406: 39.92,17.18 37.97,15.24 U4.8 C2.1 32.77,15.3 32.77,19.68 31.62,20.83 29.34,20.83 29.08,20.57 27.69,20.57 26.89,19.77 R7.2 | U8.5 24.19,5.02 v24.64,4.57 24.89,4.83 C12.+ | C1.1 15.94,15.94 16.51,16.51 v16.89,16.51 U2.8 18.92,16.51 20.7,18.29 20.96,18.29 23.66,18.29 R7.2 | R22.2 39.92,17.95 v40.89,18.92 | v47.12,19.18 48.01,19.18 49.02,18.16 49.02,17.02 51.05,14.99 U6.8 53.59,14.99 54.74,16.13 55.92,16.13 R23.2 56.55,17.88 C3.1 57.53,18.67 | v25.15,21.08 R7.2 | v22.99,25.53 21.84,26.67 C10.1 20.89,26.67 U7.4 18.22,29.34 v18.29,29.59 | v18.03,31.62 17.27,31.62 16.89,32 14.48,32 14.1,31.62 12.57,31.62 12.45,31.72 U7.18 9.91,34.26 C9.1
+5V  (via drill 0.41)
  Top 0.406: J7.4 23.5,3.56 21.97,5.08 v19.94,5.08
  Bottom 0.203: R39.2 19.52,6.6 19.94,6.6
  Bottom 0.406: U8.3 20.25,6.92 19.94,6.6 19.94,5.46 20.19,5.21 | 20.19,5.21 20.38,5.02 U8.1 | v19.94,5.08 20.19,5.21
+5V_2PI
  Top 0.813: U5.3 58.17,41.02 56.64,42.55 J1.2 J1.4
  Bottom 0.813: J1.4 53.98,44.09 C5.+
+DTR  (via drill 0.33)
  Top 0.305: J4.6 40.64,15.24 v39.37,13.97 35.05,13.97 33.78,12.7 29.85,12.7 29.21,13.34 29.21,13.97 J2.6 26.8,14.1 24.51,14.1 24,14.61 21.59,14.61 21.25,14.26 R20.1
  Bottom 0.305: U4.6 38.1,12.7 v39.37,13.97
+RX
  Top 0.254: R30.1 21.25,18.96
  Top 0.305: J4.8 39.62,17.78 37.97,16.13 35.69,16.13 34.67,17.14 31.75,17.14 31.12,17.78 J2.8 26.04,17.78 24,19.81 22.1,19.81 21.25,18.96
  Bottom 0.254: U6.6 51.43,12.45 48.64,15.24 47.24,15.24 46.23,16.26 46.23,16.64 J4.8
+TX  (via drill 0.33)
  Top 0.254: J4.2 44.2,10.16 43.69,9.65 39.75,9.65 38.23,11.18 35.43,11.18 33.91,9.65 31.62,9.65 31.12,10.16 J2.2 27.18,10.16 26.8,9.78 24.26,9.78 23.88,10.16 22.52,10.16 R9.1 21.25,11.39 19.81,12.83 v19.81,13.84
  Bottom 0.254: U2.6 19.69,13.97 v19.81,13.84
-DTR  (via drill 0.33)
  Top 0.305: J4.3 46.35,12.7 46.35,13.46 45.85,13.97 40.77,13.97 39.75,12.95 v35.31,12.95 35.18,12.95 34.16,11.94 30.99,11.94 J2.3 27.18,11.43 26.54,12.06 26.54,12.95 26.16,13.34 R20.2
  Bottom 0.305: U4.7 35.81,13.97 35.31,13.46 v35.31,12.95
-RX
  Top 0.305: R30.2 24.13,18.41 26.04,16.51 J2.7 34.29,16.51 35.31,15.49 38.35,15.49 39.88,17.02 43.81,17.02 44.32,16.51 J4.7
  Bottom 0.254: U6.7 51.18,13.72 48.39,16.51 J4.7
-TX  (via drill 0.33)
  Top 0.254: J4.1 39.5,8.89 37.97,10.41 35.69,10.41 34.16,8.89 J2.1 27.31,8.89 27.05,9.14 24.26,9.14 24,8.89 R9.2 21.81,7.49 20.83,7.49 19.94,8.38 19.94,11.68 18.92,12.7 18.92,14.1 v19.81,14.99
  Bottom 0.254: U2.7 19.56,15.24 v19.81,14.99
DTR_!RE  (via drill 0.33)
  Top 0.203: v21.59,23.75 21.34,24 21.34,25.4 18.67,28.07 17.65,28.07 17.4,28.32 15.62,28.32 15.11,28.83 14.73,28.83 v14.61,28.96
  Bottom 0.203: U4.2 42.67,13.97 43.18,14.48 43.18,21.08 42.54,21.72 38.99,21.72 38.23,22.48 34.92,22.48 33.78,23.62 32.77,23.62 31.75,24.64 30.1,24.64 28.96,25.78 27.69,25.78 26.29,24.38 26.04,24.38 25.53,23.88 23.75,23.88 23.24,23.37 21.97,23.37 v21.59,23.75 | R21.2 8.13,23.88 8.89,24.64 9.14,24.64 10.03,25.53 13.12,25.53 U7.10 14.99,27.4 14.99,28.57 v14.61,28.96
DTR_DE  (via drill 0.33)
  Top 0.203: v30.1,19.43 30.1,20.07 31.5,21.46 v31.5,23.75 | v21.08,22.73 20.96,22.73 20.7,22.99 20.7,25.15 18.42,27.43 17.4,27.43 17.15,27.69 15.37,27.69 15.11,27.94 14.61,27.94 13.08,26.42 v12.7,26.42
  Bottom 0.203: R25.2 33.27,11.56 31.75,13.08 31.75,15.75 32,16 32,18.8 31.88,18.92 30.61,18.92 v30.1,19.43 | v31.5,23.75 31.24,24 29.72,24 28.58,25.15 27.94,25.15 26.54,23.75 26.29,23.75 25.78,23.24 24,23.24 23.5,22.73 v21.08,22.73 | U7.11 12.87,26.42 v12.7,26.42
DTR_RXD  (via drill 0.33)
  Top 0.203: v29.34,22.48 29.34,22.61 29.21,22.73 29.21,29.21 28.19,30.23 28.19,36.45 27.81,36.83 v27.18,36.83
  Bottom 0.203: R26.2 39.5,20.32 37.97,21.84 33.02,21.84 32.64,22.23 30.73,22.23 30.48,22.48 v29.34,22.48 | U7.30 21,34.54 22.86,34.54 23.37,35.05 23.37,35.31 24.13,36.07 25.15,36.07 25.91,36.83 v27.18,36.83
DTR_TXD  (via drill 0.33)
  Top 0.203: v30.48,25.53 30.73,25.78 30.73,29.21 v30.61,29.34 | v25.27,31.37 25.27,32.51 24.13,33.66 v22.86,33.66
  Bottom 0.203: U4.4 42.67,11.43 43.31,12.06 43.31,13.72 43.81,14.22 43.81,21.34 42.8,22.35 39.24,22.35 38.48,23.11 35.43,23.11 34.42,24.13 33.15,24.13 32,25.27 30.73,25.27 v30.48,25.53 | v30.61,29.34 30.1,29.84 27.69,29.84 27.43,30.1 27.43,31.24 27.31,31.37 v25.27,31.37 | v22.86,33.66 21.24,33.66 U7.31
  Bottom 0.254: R24.2 41.4,9.91 41.53,10.03 41.53,10.29 41.91,10.67 U4.4
HOST_!CTS  (via drill 0.33)
  Top 0.203: v13.72,37.97 13.84,38.1 16.76,38.1 17.4,38.73 25.27,38.73 26.29,37.72 26.29,36.2 v26.54,35.94
  Bottom 0.203: U1.1 32.51,36.83 32.26,37.08 30.99,37.08 30.1,36.2 27.81,36.2 27.56,35.94 v26.54,35.94 26.5,35.9 R8.1 | U7.23 13.59,36.23 13.59,37.85 v13.72,37.97
HOST_!DSR
  Bottom 0.203: U7.24 15.65,36.96 TP9.TP
HOST_!DTR
  Bottom 0.203: U7.32 21.44,31.62 TP12.TP
HOST_!RTS
  Bottom 0.203: U7.1 21.23,29.72 22.86,29.72 23.75,28.83 24.98,28.83 R5.1 | R5.1 26.29,29.97 26.5,29.76 | U1.8 27.56,29.21 26.67,30.1 R5.1
HOST_MISO  (via drill 0.33)
  Top 0.203: v43.43,28.19 43.43,38.48 42.54,39.37 42.54,40.64 v41.91,41.27
  Bottom 0.203: R15.2 32,43.56 32.38,43.18 32.38,41.27 | 32.38,41.27 J1.21 | v43.43,28.19 43.81,28.57 U3.4 | 32.38,41.27 v41.91,41.27
HOST_MOSI  (via drill 0.33)
  Top 0.203: J1.19 34.92,38.73 36.45,38.73 37.21,37.97 37.85,37.97 37.85,34.16 39.24,32.77 40.13,32.77 40.26,32.64 40.26,31.37 41.15,30.48 v41.15,29.08
  Bottom 0.203: v41.15,29.08 40.64,28.57 U3.11
HOST_RX  (via drill 0.33)
  Top 0.203: v26.16,18.8 26.16,19.18 26.8,19.81 v26.8,21.97 | v33.4,22.73 33.02,23.11 33.02,27.43 33.78,28.19 33.78,29.59 33.27,30.1 33.27,33.78 v32.77,34.29
  Bottom 0.203: U2.1 23.84,16.51 R7.1 25.15,17.91 25.27,17.91 v26.16,18.8 | v26.8,21.97 26.92,22.1 27.94,22.1 28.32,22.48 28.32,22.86 28.7,23.24 30.73,23.24 31.12,22.86 33.27,22.86 v33.4,22.73 | v32.77,34.29 U1.3
HOST_SCK  (via drill 0.33)
  Top 0.203: v37.46,39.12 37.97,38.61 38.48,38.61 38.48,34.42 39.5,33.4 40.64,33.4 40.89,33.15 40.89,32 v41.15,31.75
  Bottom 0.203: v37.46,39.12 37.08,38.73 29.85,38.73 J1.23 | v41.15,31.75 41.15,31.5 40.77,31.11 U3.13
HOST_TX  (via drill 0.33)
  Top 0.203: v49.66,12.95 49.66,17.27 48.77,18.16 v48.77,20.07 | v45.59,20.19 45.59,22.61 44.2,24 43.31,24 v43.05,24.26 | v38.1,26.92 37.08,27.94 37.08,29.97 v36.58,30.48 | v32.13,30.48 31.88,30.73 v31.88,32.38
  Bottom 0.203: 51.18,11.81 55.37,11.81 | R32.1 50.29,12.32 v49.66,12.95 | v48.77,20.07 45.97,20.07 45.85,20.19 v45.59,20.19 | v43.05,24.26 43.05,25.27 42.54,25.78 42.54,26.04 41.91,26.67 38.35,26.67 v38.1,26.92 | v36.58,30.48 U1.6 v32.13,30.48 | v31.88,32.38 27.14,32.38 R6.1
  Bottom 0.254: R32.1 50.76,11.39 51.18,11.81 | 55.37,11.81 56.01,11.18 U6.4
IOREF
  Bottom 0.203: J8.2 51.56,30.86 52.07,31.37 R16.1 | R16.1 R27.1 | R16.1 51.86,32.3 51.18,32.98 51.18,33.53 50.8,33.91 50.51,33.91 R17.1
LED_BUILTIN
  Top 0.203: D2.K 7.87,28.19 TP4.TP
  Bottom 0.203: U7.13 12.13,27.94 10.92,27.94 10.67,28.19 8.64,28.19 TP4.TP
MGR_!RESET  (via drill 0.33)
  Top 0.203: v20.83,36.58 19.43,36.58 19.05,36.2 16.89,36.2 16.51,35.81 15.24,35.81 13.97,37.08 13.33,37.08 12.7,37.72 12.7,38.1 12.06,38.73 8.51,38.73 v8.26,38.48
  Bottom 0.203: J9.5 4.83,37.72 | 4.83,37.72 2.67,39.88 D1.A 2.52,41.34 R35.1 | U7.29 20.83,35.5 v20.83,36.58 | v8.26,38.48 5.59,38.48 4.83,37.72
MGR_AREF
  Bottom 0.203: U7.20 11.05,35.38 C14.1 10.29,35.81 TP5.TP
MGR_MISO
  Bottom 0.203: U7.16 10.39,29.59 9.78,29.59 8.38,30.99 6.48,30.99 J9.1
MGR_MOSI
  Bottom 0.203: U7.15 10.89,28.96 9.53,28.96 8.13,30.35 5.08,30.35 4.45,30.99 4.45,33.02 J9.4
MGR_SCK
  Bottom 0.203: U7.17 11.18,31.85 11.18,31.37 10.16,30.35 9.91,30.35 8.64,31.62 7.37,31.62 6.98,32 6.98,33.02 J9.3
MISO
  Bottom 0.203: J8.1 48.26,30.48 47.62,29.84 U3.3
MOSI
  Bottom 0.203: J8.4 52.28,27.22 R18.1
N$1
  Bottom 0.203: R2.2 48.51,43.69 48.89,43.31 J1.8 47.62,41.27 47.62,39.37 46.86,38.61 46.23,38.61 43.69,36.07 41.4,36.07 40.77,36.7 36.7,36.7 36.32,36.32 36.32,33.4 35.43,32.51 35.43,32.13 35.05,31.75 U1.5
N$2
  Bottom 0.203: U3.9 37.46,26.04 36.7,26.8 R38.2
N$4  (via drill 0.33)
  Top 0.203: v30.23,37.72 v30.23,31.24
  Bottom 0.203: R1.2 44.2,44.07 45.09,43.18 45.09,42.04 43.81,40.77 J1.11 43.81,37.97 43.05,37.21 41.78,37.21 40.89,38.1 30.61,38.1 v30.23,37.72 | v30.23,31.24 30.23,30.86 29.85,30.48 U1.9
N$5
  Bottom 0.203: R16.2 51.85,34.51 50.67,35.69 49.15,35.69 47.97,34.51 R19.2 46.35,33.23 46.35,32 46.1,31.75 43.94,31.75 42.04,29.84 U3.12
N$6
  Bottom 0.203: R18.2 52.36,29.17 52.2,29.21 50.29,29.21 | 50.29,29.21 43.31,29.21 41.4,27.3 U3.10 | R17.2 49.91,31.88 50.29,31.5 50.29,29.21
N$7
  Bottom 0.203: S2.2 6.31,18.45 R44.2 R43.1 6.31,24.73 S2.1
N$10  (via drill 0.33)
  Top 0.203: v53.09,30.86 53.09,30.23 52.07,29.21 51.05,29.21 50.29,28.45 50.29,27.18 49.78,26.67 44.2,26.67 v43.56,26.04
  Bottom 0.203: v53.09,30.86 53.34,31.11 54.86,31.11 55.5,31.75 55.5,33.02 54.23,34.29 R27.2 54.23,35.43 54.86,36.07 R33.2 | v43.56,26.04 U3.6
N$11  (via drill 0.33)
  Top 0.254: v51.82,10.03 52.96,11.18 54.99,11.18 v56.26,12.45
  Bottom 0.254: R34.2 47.33,5.75 Q3.3(D) 50.55,6.35 51.18,6.99 51.18,8.64 51.82,9.27 v51.82,10.03 | v56.26,12.45 U6.3
N$15
  Bottom 0.254: Q1.1(G) 25.53,9.19 R13.1
N$18
  Bottom 0.254: 22.29,12.13 22.1,12.32 22.1,13.46 22.61,13.97 U2.3 | 22.29,12.13 23.03,11.39 Q1.3(D) | R11.1 20.66,10.5 22.29,12.13
N$19
  Bottom 0.254: R22.1 41.87,20.19 R26.1
  Bottom 0.305: U4.1 41.91,17.23 R22.1
N$20
  Bottom 0.254: U4.3 40.89,12.7 40.64,12.45 40.64,10.41 39.62,9.4 39.62,6.48 37.97,4.83 35.56,4.83 33.44,6.94 Q2.3(D) 32.64,8.13 33.27,8.76 R25.1
N$22
  Bottom 0.254: Q2.1(G) 33.59,5.02 34.54,4.06 38.44,4.06 R24.1
N$24
  Bottom 0.254: C11.1 24.77,7.24 24.45,6.92 U8.4
N$25
  Bottom 0.305: Q3.1(G) 50.12,9.35 R32.2
N$29  (via drill 0.33)
  Top 0.203: D2.A 4.61,29.68 v4.19,30.1
  Bottom 0.203: R45.2 5.17,29.12 v4.19,30.1
PI3V3  (via drill 0.41)
  Top 0.305: v40,35.05 40,36.83 41.4,38.23 v42.29,38.23
  Top 0.406: J1.1 55.24,41.27 50.67,41.27 50.16,41.78 50.16,45.09 47.62,47.62 v47.5,47.62
  Bottom 0.305: U1.14 28.7,36.92 C7.1 28.07,38.73 27.94,38.73 27.31,39.37 27.31,44.83 27.39,44.92 R28.1 | U3.14 39.62,32.55 C6.1 39.75,34.16 39.75,34.8 v40,35.05 | v42.29,38.23 42.54,38.48 42.54,40.64 43.05,41.15 43.05,41.4 42.54,41.91 42.54,46.44
  Bottom 0.406: 47.5,46.44 v47.5,47.62 | R2.1 47.5,46.44 | 47.5,46.44 R4.2 R1.1 42.54,46.44 42.54,48.26 42.04,48.77 32.89,48.77 32,47.88 R15.1 | 32.13,46.44 R15.1 | R15.1 R3.2 27.43,46.32 R28.1
PI3V3_ADC7
  Bottom 0.203: R28.2 16.64,46.35 15.03,44.74 R29.1 12.66,44.74 C8.1 12.57,44.2 12.06,43.69 12.06,38.99 12.83,38.23 12.83,35.86 U7.22
PI_!CTS  (via drill 0.33)
  Top 0.203: J1.36 13.84,42.04 14.22,42.04 14.99,41.27 16.38,41.27 16.76,41.66 17.53,41.66 17.91,41.27 18.92,41.27 19.3,41.66 20.07,41.66 20.45,41.27 v29.85,41.27 29.85,39.37 31.5,37.72 v31.5,36.2
  Bottom 0.203: v29.85,41.27 29.85,43.18 29.59,43.43 R3.1 | U1.2 32.13,35.56 v31.5,36.2
PI_RX
  Bottom 0.203: R4.1 J1.10 46.35,42.42 45.09,41.15 45.09,38.35 43.31,36.58 41.66,36.58 40.89,37.34 36.07,37.34 35.69,36.96 35.69,33.66 35.05,33.02 U1.4
PI_SCL
  Top 0.203: R41.1 50.89,38.19 51.43,38.73 J1.5
PI_SDA
  Top 0.203: R42.1 54.7,39.28 J1.3
RX
  Bottom 0.203: R33.1 58.29,36.07 59.18,36.96 59.18,45.34 56.13,48.39 51.31,48.39 J3.3
RX_!RE  (via drill 0.33)
  Top 0.203: v54.61,13.72 51.43,13.72 51.05,14.1 v51.05,16.26
  Bottom 0.203: U6.2 v54.61,13.72 | v51.05,16.26 49.78,17.53 49.78,18.67 49.66,18.8 49.66,20.57 48.51,21.72 47.75,21.72 47.5,21.46 46.35,21.46 45.97,21.84 45.59,21.84 45.09,22.35 43.69,22.35 43.05,22.99 39.5,22.99 38.73,23.75 37.85,23.75 36.32,25.27 33.78,25.27 32,27.05 26.29,27.05 25.78,27.56 25.15,27.56 24.64,27.05 23.88,27.05 23.37,27.56 23.37,28.32 22.73,28.96 20.86,28.96 U7.2
  Bottom 0.254: R31.1 58.13,9.61 59.05,10.54 59.05,13.21 58.55,13.72 U6.2
RX_DE  (via drill 0.33)
  Top 0.203: v46.61,10.16 48.89,10.16 50.55,11.81 50.55,13.46 50.42,13.59 50.42,17.4 49.4,18.41 49.4,19.3 49.66,19.56 49.66,20.45 49.15,20.95 48.26,20.95 v48.13,20.83 | v44.7,21.46 44.96,21.72 44.96,22.35 43.94,23.37 42.8,23.37 42.04,24.13 42.04,25.53 41.91,25.65 v41.66,25.65 | v26.67,27.94 26.67,29.34 26.92,29.59 26.92,34.42 26.04,34.42 25.02,35.43 25.02,37.08 24.38,37.72 18.92,37.72 v18.29,37.08
  Bottom 0.203: R34.1 45.85,9.02 46.61,9.78 v46.61,10.16 | v48.13,20.83 46.1,20.83 45.72,21.21 44.96,21.21 v44.7,21.46 | v41.66,25.65 41.4,25.4 37.21,25.4 36.83,25.78 34.16,25.78 32.26,27.69 26.92,27.69 v26.67,27.94 | U7.26 18.29,36.36 v18.29,37.08
RX_RPU  (via drill 0.33)
  Top 0.203: v47.37,25.78 47.37,25.27 48.51,24.13 49.66,24.13 50.42,23.37 54.99,23.37 56.64,21.72 56.64,15.62 v56.01,14.99
  Bottom 0.203: v47.37,25.78 47.37,26.67 46.86,27.3 U3.5 | v56.01,14.99 U6.1
  Bottom 0.305: U6.1 57.66,15.91 R23.1
SCK  (via drill 0.33)
  Top 0.203: J8.3 47.75,29.21 47.75,30.86 v47.5,31.11
  Bottom 0.203: v47.5,31.11 47.5,32.13 R19.1
SCL  (via drill 0.33)
  Top 0.203: v19.69,44.45 16.64,47.5 6.1,47.5 4.19,49.4 J5.1
  Bottom 0.203: J5.1 5.04,49.95 R37.1 | U7.28 19.94,35.74 19.94,38.99 19.69,39.24 v19.69,44.45
SCL1  (via drill 0.33)
  Top 0.203: R41.2 50.16,39.08 50.16,40.64 49.53,41.27 48.39,41.27 47.62,42.04 47.62,43.69 44.45,46.86 v40.77,46.86 | v34.29,46.86 22.99,46.86 22.23,46.1 v22.23,44.45 | v21.97,36.58 21.97,36.45 21.21,35.69 19.81,35.69 16.26,32.13 v16.26,29.97
  Bottom 0.203: v40.77,46.86 v34.29,46.86 | v22.23,44.45 22.23,38.99 21.97,38.73 v21.97,36.58 | U7.6 16.51,28.78 16.51,29.34 16.26,29.59 v16.26,29.97
SDA  (via drill 0.33)
  Top 0.203: v17.15,44.45 17.15,45.85 16.26,46.74 6.86,46.74 v6.6,46.48
  Bottom 0.203: J5.2 6.22,50.29 6.22,46.48 | 6.22,46.48 6.22,45.85 5.08,44.7 R36.1 | U7.27 19.18,36.11 19.18,38.35 18.92,38.61 17.78,38.61 17.15,39.24 v17.15,44.45 | v6.6,46.48 6.22,46.48
SDA1  (via drill 0.33)
  Top 0.203: R42.2 52.7,37.72 51.43,36.45 48.51,36.45 47.75,37.21 47.75,39.24 47.62,39.37 47.62,40.77 47.12,41.27 45.85,41.27 45.09,42.04 45.09,43.56 43.69,44.96 v40.77,44.96 | v34.54,44.96 25.27,44.96 v24.77,44.45 | v22.1,35.43 21.72,35.05 20.32,35.05 18.42,33.15 18.42,32.51 19.3,31.62 19.3,29.59 v20.96,27.94
  Bottom 0.203: v40.77,44.96 v34.54,44.96 | v24.77,44.45 24.77,39.37 24.13,38.73 23.11,38.73 22.86,38.48 22.86,36.2 v22.1,35.43 | 20.83,27.94 v20.96,27.94 20.75,27.94 U7.3
SHUTDOWN  (via drill 0.33)
  Top 0.203: J1.31 17.78,39.37 17.15,39.37 16.51,38.73 15.24,38.73 14.61,39.37 14.61,40.51 13.84,41.27 6.6,41.27 5.21,39.88 5.21,38.35 5.33,38.23 6.22,38.23 6.98,37.47 6.98,36.2 6.73,35.94 6.73,35.18 7.11,34.8 7.11,33.91 7.24,33.78 8,33.78 8.64,34.42 9.53,34.42 10.03,33.91 10.03,33.15 9.27,32.38 7.62,32.38 6.98,31.75 v6.98,29.59
  Bottom 0.203: R44.1 3.17,22.14 3.17,23.75 4.57,25.15 4.95,25.15 6.98,27.18 v6.98,29.59
SHUTDWN  (via drill 0.33)
  Top 0.203: TP1.TP 8.89,25.4 7.62,24.13 v5.33,24.13
  Bottom 0.203: U7.12 12.63,27.3 10.79,27.3 9.53,26.04 TP1.TP | v5.33,24.13 4.36,23.15 R43.2
TX  (via drill 0.33)
  Top 0.203: v38.23,29.21 38.23,28.96 38.86,28.32 38.86,22.86 37.85,21.84 35.81,21.84 33.53,19.56 31.37,19.56 v31.12,19.81 | R14.2 26.42,23.62 27.69,22.35 27.69,20.19 27.94,19.94 v27.94,19.56
  Bottom 0.203: J3.4 47.62,49.53 49.28,49.53 51.05,47.75 55.88,47.75 58.55,45.09 58.55,37.72 58.29,37.47 55.24,37.47 53.72,35.94 51.31,35.94 50.93,36.32 48.89,36.32 48.26,35.69 46.99,35.69 46.23,34.92 46.23,34.04 44.99,32.8 U3.1 43.69,32.38 41.78,30.48 38.48,30.48 38.23,30.23 v38.23,29.21 | v31.12,19.81 30.73,20.19 29.59,20.19 29.34,19.94 28.32,19.94 v27.94,19.56 26.67,18.29 26.67,18.03 26.54,17.91 26.54,17.4 25.78,16.64 25.78,15.88 25.4,15.49 25.4,12.32 25.91,11.81 R13.2
TX_!RE  (via drill 0.33)
  Top 0.203: v21.72,16.26 21.46,16.51 20.32,16.51 19.43,17.4 19.43,19.43 21.08,21.08 22.73,21.08 v23.24,21.59 | v17.27,37.47 18.03,38.23 24.89,38.23 25.65,37.47 25.65,35.56 26.16,35.05 27.43,35.05 27.56,34.92 27.56,29.84 28.58,28.83 28.58,24.64 v28.19,24.26
  Bottom 0.203: U2.2 22.73,15.24 v21.72,16.26 | R10.2 22.99,21.34 v23.24,21.59 24.26,22.61 26.16,22.61 26.54,22.99 26.92,22.99 v28.19,24.26 | U7.25 17.27,36.47 v17.27,37.47
TX_DE
  Bottom 0.203: R11.2 17.95,11.18 16.26,11.18 14.1,13.34 14.1,16.51 12.57,18.03 11.05,18.03 9.53,19.56 9.53,22.35 9.02,22.86 9.02,23.62 10.29,24.89 13.61,24.89 U7.9
TX_RPU  (via drill 0.33)
  Top 0.203: v24.89,16.26 24,17.14 20.57,17.14 20.07,17.65 20.07,19.05 21.46,20.45 23.62,20.45 v23.88,20.7 | v32.38,21.34 32.38,28.19 32.51,28.32 v32.51,29.34
  Bottom 0.203: v24.89,16.26 24.77,16.13 24.77,13.34 24.13,12.7 U2.4 | v32.38,21.34 32.13,21.59 28.96,21.59 28.7,21.34 27.43,21.34 27.05,20.95 26.29,20.95 26.04,21.21 26.04,21.59 25.65,21.97 24.64,21.97 24.13,21.46 24.13,21.21 23.88,20.95 v23.88,20.7 23.75,20.57 23.75,19.81 23.11,19.18 22.1,19.18 21.46,19.81 20.07,19.81 18.96,18.71 R12.2 | v32.51,29.34 32.51,29.21 33.27,28.45 37.85,28.45 38.35,27.94 41.27,27.94 44.45,31.11 U3.2
VIN
  Top 0.61: 55.56,4.89 55.37,4.7 51.12,4.7 50.93,4.83 | 38.73,4.83 38.54,4.7 34.54,4.7
  Top 0.813: J7.1 32.38,2.54 34.54,4.7 | 55.56,4.89 58.67,8 58.67,27.43 U5.1 | 50.93,4.83 38.73,4.83
  Bottom 0.61: C4.1 U5.1
XTAL1
  Bottom 0.203: U7.7 18,26.16 18.8,26.16 19.56,25.4 19.56,24.64 19.05,24.13 18.29,24.13 17.86,23.7 Y1.1 17.86,22.31 16,20.45 C15.1 16,19.81
XTAL2
  Bottom 0.203: C16.1 13.84,20.83 12.36,22.31 Y1.2 14.1,23.11 15.88,24.89 17.15,24.89 17.53,25.27 17.53,25.5 U7.8

### Text on the board
tPlace: 0V | 13 | 12 | 11 | 10 | 9 | 8 | 7 | 6 | 5 | 4 | 3 | 2 | TX | RX | SCL | SDA | +5V | !RST | 0V | MOSI | MGR / AREF | PI3V3 | HOST / !DSR | SCK | RPUpi | RPUBUS.ORG | +5V | 3V3 | 16197^2 | MISO | HOST / !DTR | MISO | IOREF | MNG / ICSP | OC1A | SCK | MOSI | ICP1 | !RESET | 0V | VIN | 100Ω / TERMINATIONS | +RX | -RX | SHUTDOWN | +DTR | -DTR | +TX | -TX | IOREF | !RESET | 3V3 | 5V | 0V | 0V | VIN | ADC2 | ADC4 | ADC6 | ADC0 | ADC1 | ADC3 | ADC5 | ADC7 | 0V
bPlace: RPUpi | RPUBUS.ORG